# Altium schematic sheet Ball Locator.SchDoc
size A4
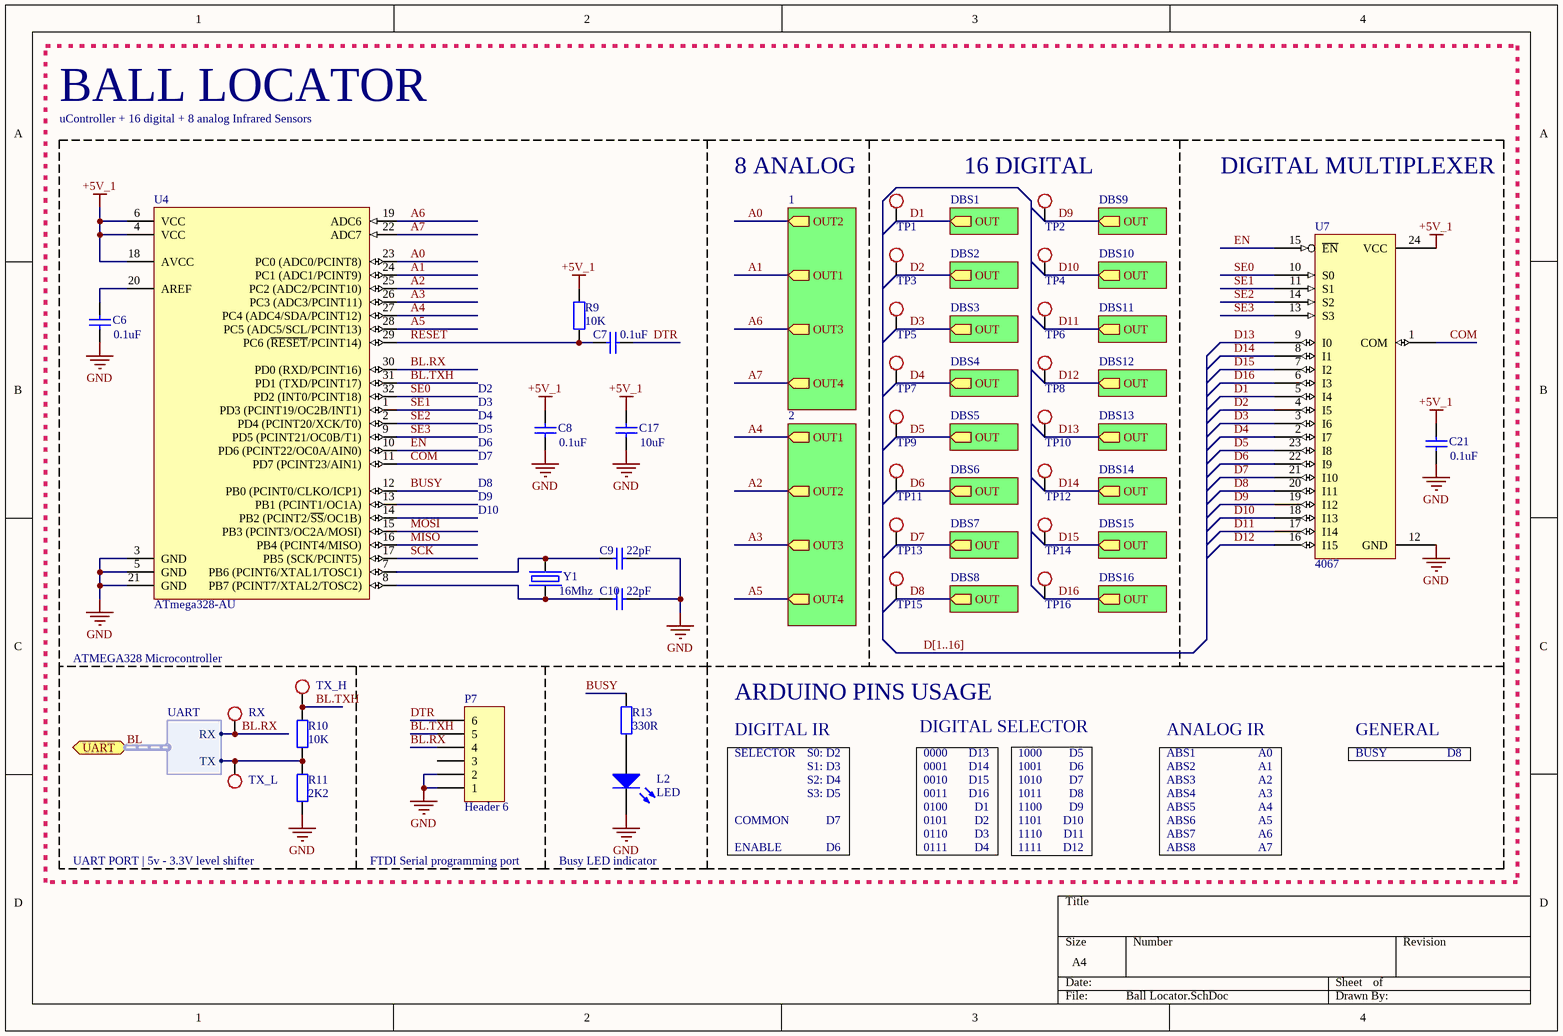
[diagram p0: Ball Locator.SchDoc]

## Parts
C6  0.1uF  [C0805]
C7  0.1uF  [C0805]
C8  0.1uF  [C0805]
C9  22pF  [C0805]
C10  22pF  [C0805]
C17  10uF  [C1206]
C21  0.1uF  [C0805]
L2  LED  [LED0805]
P7  Header 6  [HDR1X6]
R9  10K  [RES1206]
R10  10K  [RES1206]
R11  2K2  [RES1206]
R13  330R  [RES1206]
RX  Test Point  [TP1]  (value not drawn)  (no BOM)
TP1  Test Point  [TP1]  (value not drawn)
TP2  Test Point  [TP1]  (value not drawn)
TP3  Test Point  [TP1]  (value not drawn)
TP4  Test Point  [TP1]  (value not drawn)
TP5  Test Point  [TP1]  (value not drawn)
TP6  Test Point  [TP1]  (value not drawn)
TP7  Test Point  [TP1]  (value not drawn)
TP8  Test Point  [TP1]  (value not drawn)
TP9  Test Point  [TP1]  (value not drawn)
TP10  Test Point  [TP1]  (value not drawn)
TP11  Test Point  [TP1]  (value not drawn)
TP12  Test Point  [TP1]  (value not drawn)
TP13  Test Point  [TP1]  (value not drawn)
TP14  Test Point  [TP1]  (value not drawn)
TP15  Test Point  [TP1]  (value not drawn)
TP16  Test Point  [TP1]  (value not drawn)
TX_H  Test Point  [TP1]  (value not drawn)  (no BOM)
TX_L  Test Point  [TP1]  (value not drawn)  (no BOM)
U4  ATmega328-AU  [32A_N]
U7  4067  [SSOP-24]
Y1  16Mhz  [OSC-2-PIN-TH]

## Sub-sheets
1 = Analog Ball Sensor.SchDoc: OUT1 (out), OUT2 (out), OUT3 (out), OUT4 (out)
2 = Analog Ball Sensor.SchDoc: OUT1 (out), OUT2 (out), OUT3 (out), OUT4 (out)
DBS1 = Digital Ball Sensor.SchDoc: OUT (out)
DBS2 = Digital Ball Sensor.SchDoc: OUT (out)
DBS3 = Digital Ball Sensor.SchDoc: OUT (out)
DBS4 = Digital Ball Sensor.SchDoc: OUT (out)
DBS5 = Digital Ball Sensor.SchDoc: OUT (out)
DBS6 = Digital Ball Sensor.SchDoc: OUT (out)
DBS7 = Digital Ball Sensor.SchDoc: OUT (out)
DBS8 = Digital Ball Sensor.SchDoc: OUT (out)
DBS9 = Digital Ball Sensor.SchDoc: OUT (out)
DBS10 = Digital Ball Sensor.SchDoc: OUT (out)
DBS11 = Digital Ball Sensor.SchDoc: OUT (out)
DBS12 = Digital Ball Sensor.SchDoc: OUT (out)
DBS13 = Digital Ball Sensor.SchDoc: OUT (out)
DBS14 = Digital Ball Sensor.SchDoc: OUT (out)
DBS15 = Digital Ball Sensor.SchDoc: OUT (out)
DBS16 = Digital Ball Sensor.SchDoc: OUT (out)

## Ports
UART (harness UART)

## Harnesses
UART: RX, TX

## Nets
+5V_1: C8.2 C17.2 C21.2 R9.1 U4.4(VCC) U4.6(VCC) U4.18(AVCC) U7.24(VCC)
GND: C6.1 C8.1 C9.2 C10.2 C17.1 C21.1 L2.2(K) P7.1 P7.2 R11.1 U4.3(GND) U4.5(GND) U4.21(GND) U7.12(GND)
A0: U4.23(PC0_(ADC0/PCINT8)) ; sheet 1/OUT2
A1: U4.24(PC1_(ADC1/PCINT9)) ; sheet 1/OUT1
A2: U4.25(PC2_(ADC2/PCINT10)) ; sheet 2/OUT2
A3: U4.26(PC3_(ADC3/PCINT11)) ; sheet 2/OUT3
A4: U4.27(PC4_(ADC4/SDA/PCINT12)) ; sheet 2/OUT1
A5: U4.28(PC5_(ADC5/SCL/PCINT13)) ; sheet 2/OUT4
A6: U4.19(ADC6) ; sheet 1/OUT3
A7: U4.22(ADC7) ; sheet 1/OUT4
BL.RX: P7.4 RX.1 U4.30(PD0_(RXD/PCINT16)) ; port UART.RX
BL.TX: R10.1 R11.2 TX_L.1 ; port UART.TX
BL.TXH: P7.5 R10.2 TX_H.1 U4.31(PD1_(TXD/PCINT17))
BUSY: R13.2 U4.12(PB0_(PCINT0/CLKO/ICP1))
COM: U4.11(PD7_(PCINT23/AIN1)) U7.1(COM)
D1: TP1.1 U7.5(I4) ; sheet DBS1/OUT
D2: TP3.1 U7.4(I5) ; sheet DBS2/OUT
D3: TP5.1 U7.3(I6) ; sheet DBS3/OUT
D4: TP7.1 U7.2(I7) ; sheet DBS4/OUT
D5: TP9.1 U7.23(I8) ; sheet DBS5/OUT
D6: TP11.1 U7.22(I9) ; sheet DBS6/OUT
D7: TP13.1 U7.21(I10) ; sheet DBS7/OUT
D8: TP15.1 U7.20(I11) ; sheet DBS8/OUT
D9: TP2.1 U7.19(I12) ; sheet DBS9/OUT
D10: TP4.1 U7.18(I13) ; sheet DBS10/OUT
D11: TP6.1 U7.17(I14) ; sheet DBS11/OUT
D12: TP8.1 U7.16(I15) ; sheet DBS12/OUT
D13: TP10.1 U7.9(I0) ; sheet DBS13/OUT
D14: TP12.1 U7.8(I1) ; sheet DBS14/OUT
D15: TP14.1 U7.7(I2) ; sheet DBS15/OUT
D16: TP16.1 U7.6(I3) ; sheet DBS16/OUT
DTR: C7.2 P7.6
EN: U4.10(PD6_(PCINT22/OC0A/AIN0)) U7.15(~{EN})
MISO: U4.16(PB4_(PCINT4/MISO))
MOSI: U4.15(PB3_(PCINT3/OC2A/MOSI))
RESET: C7.1 R9.2 U4.29(PC6_(~{RESET}/PCINT14))
SCK: U4.17(PB5_(SCK/PCINT5))
SE0: U4.32(PD2_(INT0/PCINT18)) U7.10(S0)
SE1: U4.1(PD3_(PCINT19/OC2B/INT1)) U7.11(S1)
SE2: U4.2(PD4_(PCINT20/XCK/T0)) U7.14(S2)
SE3: U4.9(PD5_(PCINT21/OC0B/T1)) U7.13(S3)
NetC6_2: C6.2 U4.20(AREF)
NetC9_1: C9.1 U4.7(PB6_(PCINT6/XTAL1/TOSC1)) Y1.1
NetC10_1: C10.1 U4.8(PB7_(PCINT7/XTAL2/TOSC2)) Y1.2
NetL2_1: L2.1(A) R13.1

Not connected (* = marked no-connect by the designer): P7 3; U4 13(PB1_(PCINT1/OC1A)) 14(PB2_(PCINT2/~{SS}/OC1B))

## Buses and harness runs
bus D[1..16]
harness BL = port UART

## Notes on the sheet
- BALL LOCATOR
- uController + 16 digital + 8 analog Infrared Sensors
- 8 ANALOG
- (near TP2) 16 DIGITAL
- DIGITAL MULTIPLEXER
- D2
- D3
- D4
- D5
- D6
- D7
- D8
- D9
- D10
- ATMEGA328 Microcontroller
- ARDUINO PINS USAGE
- SELECTOR
- DIGITAL IR
- S0: D2
- S1: D3
- S2: D4
- DIGITAL SELECTOR
- 0000
- 0001
- 0010
- D13
- D14
- D15
- 1000
- 1001
- 1010
- ANALOG IR
- ABS1
- ABS2
- ABS3
- A0
- A1
- A2
- BUSY
- GENERAL
- COMMON
- ENABLE
- S3: D5
- 0011
- 0100
- 0101
- 0110
- 0111
- D1
- D16
- 1011
- 1100
- 1101
- 1110
- 1111
- D11
- D12
- ABS4
- ABS5
- ABS6
- ABS7
- ABS8
- A3
- A4
- A5
- A6
- A7
- UART PORT | 5v - 3.3V level shifter
- FTDI Serial programming port
- Busy LED indicator

## Library data of the parts
C6-C10 C17 C21 = Cap Semi: Capacitor (Semiconductor SIM Model); Published: 8-Jun-2000; LatestRevisionDate: 29-May-2009; LatestRevisionNote: IPC-7351 Footprint Added.; PackageReference: C1206; Publisher: Altium Limited; PackageDescription: Chip Capacitor
P7 = Header 6: Header, 6-Pin; LatestRevisionDate: 17-Jul-2002; LatestRevisionNote: Re-released for DXP Platform.; Publisher: Altium Limited
R9-R11 R13 = RES
RX TP1-TP16 TX_H TX_L = Test Point: Test Point for Osciloscope measurements
U4 = ATmega328-AU: 8-bit AVR Microcontroller, 32KB Flash, 1KB EEPROM, 2KB SRAM, 32-pin TQFP, Industrial Grade (-40°C to 85°C); Published: 1-Apr-2010; DatasheetVersion: revA, Jan-2010; PackageVersion: revB, Oct-2001; PackageReference: 32A; Publisher: Altium Limited; PackageDescription: 32-Lead, 7x7x1.0 mm Body, 0.8mm Lead Pitch, Thin Profile Plastic Quad Flat Package (TQFP); Supplier 1: Digi-Key; Supplier Part Number 1: ATMEGA328-AU-ND; Supplier 2: Mouser; Supplier Part Number 2: 556-ATMEGA328-AU; Code_JEDEC: MS-026-ABA; ComponentLink1Description: Manufacturer Link; ComponentLink1URL: http://www.atmel.com/products/avr/default.asp?; ComponentLink2Description: ATmega48A/48PA/88A/88PA/168A/168PA/328/328P Datasheet; ComponentLink2URL: http://www.atmel.com/dyn/resources/prod_documents/8271.pdf; ComponentLink3Description: ATmega48A/48PA/88A/88PA/168A/168PA/328/328P Summary; ComponentLink3URL: http://www.atmel.com/dyn/resources/prod_documents/8271S.pdf; ComponentLink4Description: Atmel.com Home; ComponentLink4URL: http://www.atmel.com
U7 = MUX-74HC4067
Y1 = OSC-2-PIN: 2 pin oscilator